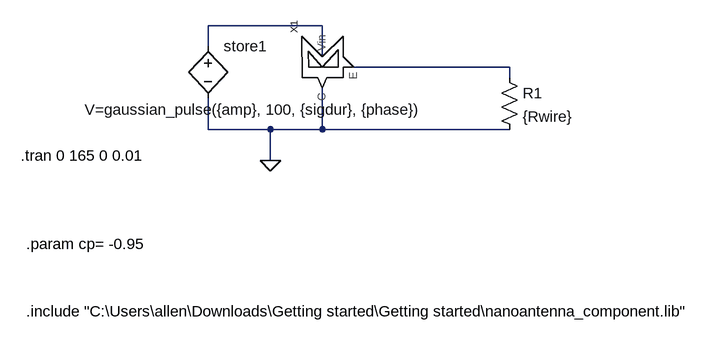
[diagram p0: schematic single_nanoantenna_test.asc]
single_nanoantenna_test.asc, the LTspice schematic file:
Version 4
SHEET 1 1280 680
WIRE 576 16 400 16
WIRE 400 48 400 16
WIRE 576 64 576 16
WIRE 864 80 624 80
WIRE 864 96 864 80
WIRE 400 176 400 128
WIRE 496 176 400 176
WIRE 576 176 576 112
WIRE 576 176 496 176
WIRE 864 176 576 176
WIRE 496 224 496 176
FLAG 496 224 0
SYMBOL bv 400 32 R0
WINDOW 3 -190 113 Left 2
SYMATTR Value V=gaussian_pulse({amp}, 100, {sigdur}, {phase})
SYMATTR InstName store1
SYMBOL res 848 80 R0
SYMATTR InstName R1
SYMATTR Value {Rwire}
SYMBOL nanoantenna_component 576 64 R270
SYMATTR InstName X1
TEXT 112 216 Left 2 !.tran 0 165 0 0.01
TEXT 120 352 Left 2 !.param cp= -0.95
TEXT 120 456 Left 2 !.include "C:\\Users\\allen\\Downloads\\Getting started\\Getting started\\nanoantenna_component.lib"

The netlist it stands for:
* single_nanoantenna_test.asc
B§store1 N001 0 V=gaussian_pulse({amp}, 100, {sigdur}, {phase})
R1 N002 0 {Rwire}
XX1 N001 N002 0 nanoantenna_component params: nanoantenna_component  ; pins Vin E C
.tran 0 165 0 0.01
.param cp= -0.95
.include "C:\Users\allen\Downloads\Getting started\Getting started\nanoantenna_component.lib"
.backanno
.end